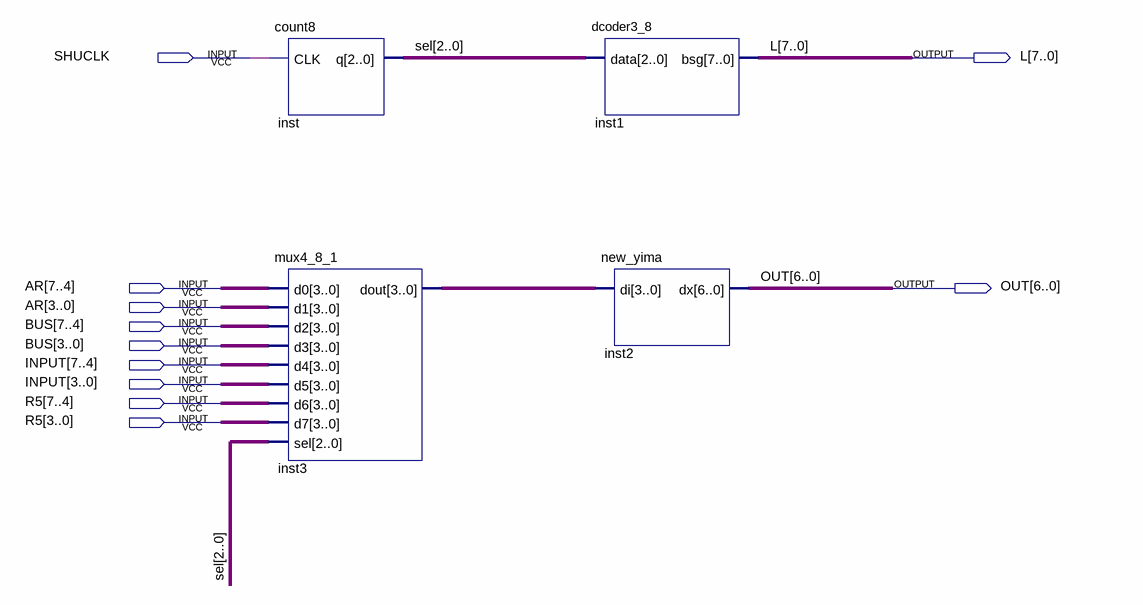
[diagram p0: schematic sheet]
// Quartus schematic xianshi1.bdf as structural Verilog: 4 symbols, 11 pins
module xianshi1 (
  input  SHUCLK,
  input  [7:0] AR,
  input  [7:0] BUS,
  input  [7:0] INPUT,
  input  [7:0] R5,
  output [7:0] L,
  output [6:0] OUT
);

  wire [2:0] sel;
  wire [3:0] inst3_dout;

  count8 inst (.CLK(SHUCLK), .q(sel));
  mux4_8_1 inst3 (
    .d0(AR[7:4]), .d1(AR[3:0]), .d2(BUS[7:4]), .d3(BUS[3:0]), .d4(INPUT[7:4]), .d5(INPUT[3:0]), .d6(R5[7:4]),
    .d7(R5[3:0]), .sel(sel), .dout(inst3_dout));
  dcoder3_8 inst1 (.data(sel), .bsg(L));
  new_yima inst2 (.di(inst3_dout), .dx(OUT));
endmodule
